# Altium project DIGLITE.PrjPcb (part 1 of 2)
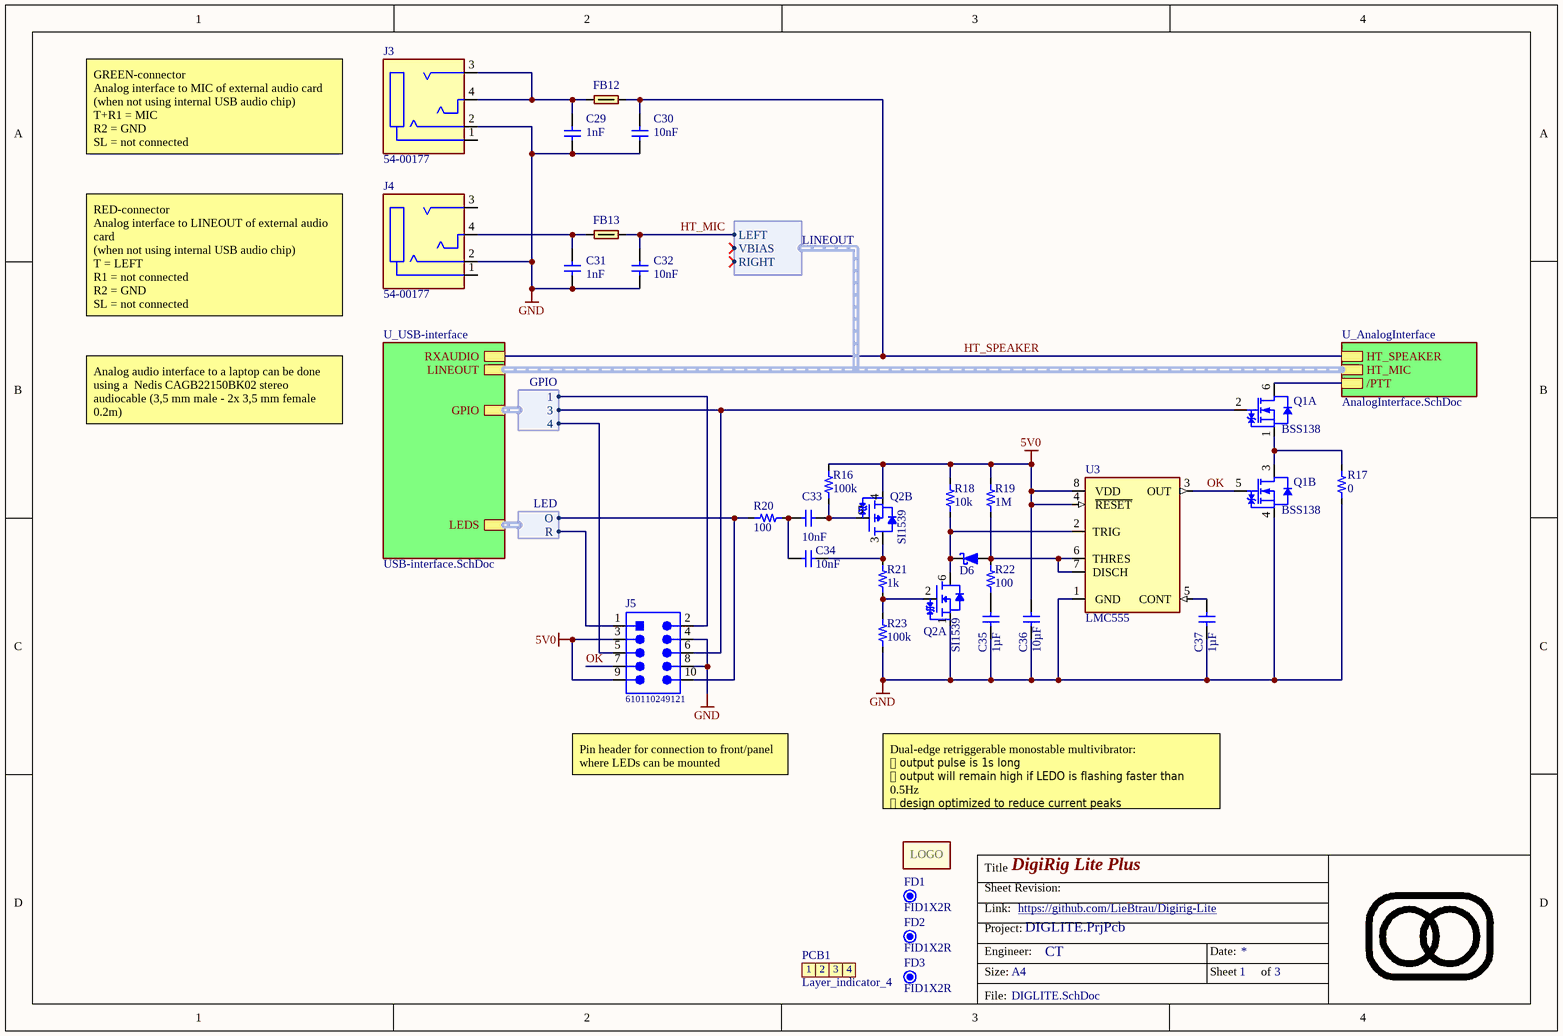
[diagram p0: DIGLITE.SchDoc]
assembly_revision: 0; board_name: DIGLITE; board_revision: 1.0; Project_link: https://github.com/LieBtrau/Digirig-Lite
3 sheets, 119 parts. Net scope: hierarchical (ports join the sheet entries above them; power ports are global).
Board file: DIGLITE.PcbDoc
Sheets:
  DIGLITE.SchDoc
    U_USB-interface = USB-interface.SchDoc
    U_AnalogInterface = AnalogInterface.SchDoc

## Sheet DIGLITE.SchDoc: DigiRig Lite Plus
size A4; Engineer: CT; SheetNumber: 1; SheetTotal: 3

### Parts
C29  value 1nF  [0603-C-N]  (hidden comment: Capacitor 1 nF +/-5% 50V C0G 0603)
C30  value 10nF  [0603-C-N]  (hidden comment: Capacitor 10nF 50V NP0 0603)
C31  value 1nF  [0603-C-N]  (hidden comment: Capacitor 1 nF +/-5% 50V C0G 0603)
C32  value 10nF  [0603-C-N]  (hidden comment: Capacitor 10nF 50V NP0 0603)
C33  value 10nF  [0603-C-N]  (hidden comment: Capacitor 10nF 50V NP0 0603)
C34  value 10nF  [0603-C-N]  (hidden comment: Capacitor 10nF 50V NP0 0603)
C35  value 1µF  [0603-C-N]  (hidden comment: Capacitor 1µF +/-10% 16V X7R 0603)
C36  value 10µF  [WCAP-CSGP_1210_L3.2W2.5H2.5]  (hidden comment: Capacitor 10µF +/-10% 50V X7R 1210)
C37  value 1µF  [0603-C-N]  (hidden comment: Capacitor 1µF +/-10% 16V X7R 0603)
D6  RB521SM-30T2R  [FP-SOD523-MFG]  (value not drawn)
FB12  742792662  [0603-FB-N]  (value not drawn)
FB13  742792662  [0603-FB-N]  (value not drawn)
FD1  FID1X2R  [FID1X2R]  (no BOM)
FD2  FID1X2R  [FID1X2R]  (no BOM)
FD3  FID1X2R  [FID1X2R]  (no BOM)
J3  54-00177  [54-00177-Footprint-1]
J4  54-00177  [54-00177-Footprint-1]
J5  610110249121  [610110249121]
M1  Logo  [LOGO_9x6mm]  (value not drawn)  (no BOM)
PCB1  Layer_indicator_4  [LayerId_4L_4x1.5mm]  (no BOM)
Q1  value BSS138  [SOT-363-N]  (hidden comment: BSS138PS.115)  (parts A,B of 2)
Q2  value SI1539  [SOT-363-N]  (hidden comment: SI1539CDL-T1-GE3)  (parts A,B of 2)
R16  value 100k  [0603-R-N]  (hidden comment: Resistor 100k +/-1% 50V 0603)
R17  value 0  [0603-R-N]  (hidden comment: Jumper 0R <50 mOhm 1A 0603)
R18  value 10k  [0603-R-N]  (hidden comment: Resistor 10k +/-1% 50V 0603)
R19  value 1M  [0603-R-N]  (hidden comment: Resistor 1M +/-1% 50V 0603)
R20  value 100  [0603-R-N]  (hidden comment: Resistor 100R +/-1% 50V 0603)
R21  value 1k  [0603-R-N]  (hidden comment: Resistor 1k +/-1% 50V 0603)
R22  value 100  [0603-R-N]  (hidden comment: Resistor 100R +/-1% 50V 0603)
R23  value 100k  [0603-R-N]  (hidden comment: Resistor 100k +/-1% 50V 0603)
U3  value LMC555  [VSSOP8]  (hidden comment: LMC555CMM/NOPB)

### Sub-sheets
U_AnalogInterface = AnalogInterface.SchDoc: /PTT, HT_SPEAKER, HT_MIC (harness LINEOUT)
U_USB-interface = USB-interface.SchDoc: RXAUDIO, LINEOUT (harness LINEOUT), LEDS (harness LED), GPIO (harness GPIO)

### Harnesses
LED: O, R
GPIO: 1, 3, 4
LINEOUT: LEFT, VBIAS, RIGHT

### Nets
5V0: C36.2 J5.3 J5.9 Q2.4(S) R16.2 R18.2 R19.2 U3.4(~{RESET}) U3.8(VDD)
GND: C29.2 C30.2 C31.2 C32.2 C35.1 C36.1 C37.1 J3.2 J4.2 J5.4 J5.8 Q1.4(S) Q2.1(S) R17.1 R23.1 U3.1(GND)
HT_MIC: C32.1 FB13.2 ; sheet U_USB-interface/LINEOUT.LEFT
HT_SPEAKER: C30.1 FB12.2 ; sheet U_USB-interface/RXAUDIO, sheet U_AnalogInterface/HT_SPEAKER
OK: J5.7 Q1.5(G) U3.3(OUT)
NetC29_1: C29.1 FB12.1 J3.3 J3.4
NetC31_1: C31.1 FB13.1 J4.4
NetC33_1: C33.1 C34.1 R20.1
NetC33_2: C33.2 Q2.5(G) R16.1
NetC34_2: C34.2 Q2.3(D) R21.1
NetC35_2: C35.2 R22.1
NetC37_2: C37.2 U3.5(CONT)
NetD6_1: D6.1(K) Q2.6(D) R18.1 U3.2(TRIG)
NetD6_2: D6.2(A) R19.1 R22.2 U3.6(THRES) U3.7(DISCH)
NetJ5_1: J5.1 ; sheet U_USB-interface/LEDS.R
NetJ5_2: J5.2 ; sheet U_USB-interface/GPIO.1
NetJ5_5: J5.5 ; sheet U_USB-interface/GPIO.4
NetJ5_6: J5.6 Q1.2(G) ; sheet U_USB-interface/GPIO.3
NetJ5_10: J5.10 R20.2 ; sheet U_USB-interface/LEDS.O
NetQ1_1: Q1.1(S) Q1.3(D) R17.2
NetQ1_6: Q1.6(D) ; sheet U_AnalogInterface//PTT
NetQ2_2: Q2.2(G) R21.2 R23.2

Not connected (* = marked no-connect by the designer): J3 1; J4 1 3

### Buses and harness runs
harness sheet U_AnalogInterface/HT_MIC = sheet U_USB-interface/LINEOUT

### Notes on the sheet
- GREEN-connector
  Analog interface to MIC of external audio card
  (when not using internal USB audio chip)
  T+R1 = MIC
  R2 = GND
  SL = not connected
- RED-connector
  Analog interface to LINEOUT of external audio card
  (when not using internal USB audio chip)
  T = LEFT
  R1 = not connected
  R2 = GND
  SL = not connected
- Analog audio interface to a laptop can be done using a  Nedis CAGB22150BK02 stereo audiocable (3,5 mm male - 2x 3,5 mm female 0.2m)
- Pin header for connection to front/panel
  where LEDs can be mounted
- Dual-edge retriggerable monostable multivibrator:
  ⦿ output pulse is 1s long
  ⦿ output will remain high if LEDO is flashing faster than 0.5Hz
  ⦿ design optimized to reduce current peaks
- Title
- Sheet Revision:
- Link:
- Size:
- Project:
- Engineer:
- A4
- Date:
- Sheet
- of
- File:
- (in symbol CMP-000006-6) 1; 2; 3; 4
- (in symbol Logo) LOGO

### Library data of the parts
C29 C31 = CMP-001-00112-14: Capacitor MLCC, General Purpose, size 0603, C0G, 1 nF, +/-5%, 50V; Page Part #: CCQK102T2; Tolerance: 5%; Case/Package: 0603; Width: 0.8mm; Min Operating Temperature: -55°C; Mounting Technology: SMT; Dielectric: C0G; Packaging: Cut Tape; Max Operating Temperature: 125°C; Voltage Rating: 50V; Height: 0.8mm; Length: 1.6mm; JLCPCB Part #: C340644; REACH SVHC: Unknown; Capacitor Type: MLCC; Usage: General Purpose; Pins: 2
C30 C32-C34 = CMP-001-00137-7: Multilayer Ceramic Capacitor, Grm Series, 0.01 F, 5%, C0g / Np0, 50 V, 0603 [1608 Metric]; FLIR Part #: YCAM10N-7; Page Part #: CCQJ103T; Temperature Coefficient: 30ppm/°C; Reach SVHC Compliant: No; Case/Package: 0603; Thickness: 0.035inch; Width: 0.8mm; Case Code (Metric): 1608; Termination: SMD/SMT; Min Operating Temperature: -55°C; Voltage Rating (DC): 50V; Mounting Technology: Surface Mount; Package Quantity: 4000; Depth: 0.8mm; Dielectric: C0G; Packaging: Cut Tape; Voltage: 50V; Max Operating Temperature: 125°C; RoHS Compliant: Yes; Material: Ceramic; Lead Pitch: 0.5mm; Case Code (Imperial): 0603; Tolerance: 5%; Voltage Rating: 50V; Lead Free: Lead Free; Height: 0.8mm; Length: 1.6mm; JLCPCB Part #: C85973; Series: GRM
C35 C37 = CMP-001-00004-22: Capacitor MLCC, General Purpose, size 0603, X7R, 1µF, +/-10%, 16V; Tolerance: 10%; Mounting Technology: SMT; Usage: General Purpose; Case/Package: 0603; Max Operating Temperature: 125°C; JLCPCB Part #: C15849; Dielectric: X7R; RoHS Compliant: True; Height: 0.8mm; Width: 0.8mm; Capacitor Type: MLCC; Voltage Rating: 16V; Length: 1.6mm; Pins: 2; Min Operating Temperature: -55°C
C36 = CMP-072-000922-16: WCAP-CSGP Multilayer Ceramic Chip Capacitor, General Purpose, size 1210, X7R, 10µF, 50VDC; Tolerance: 10%; Technical Reference: X7R1210106K050DFCT10000; Insulation Resistance: 0.01GO; Capacitor Type: MLCC; ComponentLink2URL: https://www.we-online.com/redexpert/spec/885012209073?ad; ComponentLink1URL: https://www.we-online.com/redexpert/article/885012209073?ad; Source: WCAP-CSGP.SchLib; Case/Package: 1210; Packaging: Tape and Reel; ComponentLink1Description: Website Link; Pins: 2; Width: 2.5mm; Voltage Rating: 50V; ComponentLink2Description: Datasheet Link; Match Code: WCAP-CSGP; Max Operating Temperature: 125°C; Usage: General Purpose; JLCPCB Part #: C77102; Height: 2.5mm; Dielectric: X7R; Dissipation Factor: 10%; Length: 3.2mm; Min Operating Temperature: -55°C; Design Item ID: 885012209073; Mounting Technology: SMT
D6 = CMP-004-00062-1: RB521SM Series 30 V 200 mA Surface Mount Schottky Barrier Diode -SOD-523 (SC-79); Forward Voltage: 470mV; Forward Current: 200mA; Max Repetitive Reverse Voltage (Vrrm): 30V; Max Forward Surge Current (Ifsm): 1A; Element Configuration: Single; Number of Elements: 1; Peak Reverse Current: 30µA; JLCPCB Part #: C727120; Case/Package: SOD-523-2; Packaging: Tape & Reel; Radiation Hardening: No; Max Reverse Voltage (DC): 30V; Width: 800µm; Number of Terminals: 2; Min Operating Temperature: -40°C; Average Rectified Current: 200mA; REACH SVHC: Yes; Max Operating Temperature: 150°C; RoHS: Compliant; Pins: 2; Length: 1.2mm; Peak Non-Repetitive Surge Current: 1A; Lead Free: Lead Free; Reverse Standoff Voltage: 30V; Mounting Technology: Surface Mount; Max Output current: 200mA; Height: 600µm; Lifecycle Status: Production; Weight: 992.233309µg
FB12 FB13 = CMP-066-000126-8: WE-CBF SMT EMI Suppression Ferrite Bead, size 0603, 1000O, 0.83A; Manufacturer: Wurth Elektronik; Page Part #: FILTER279; Case/Size Code: 0603; Impedance Max Test Condition: 120MHz; Type: Wide Band; DC Resistance Max: 0.3O; Impedance Max: 1050O; Rated Current: 0.6A; Mount: Surface Mount; Impedance @100MHz: 1000O; JLCPCB Part #: C180490; ComponentLink1URL: https://www.we-online.com/redexpert/article/742792662?ad; ComponentLink2URL: https://www.we-online.com/redexpert/spec/742792662?ad; Length: 1.6mm; ComponentLink1Description: Website Link; Manufacturer Part Number: 742792662; Width: 0.8mm; Match Code: WE-CBF; Component Type: Standard; Design Item ID: 742792662; Pin Count: 2; Operating Temperature Max: 125°C; Packaging: Tape and Reel; ComponentLink2Description: Datasheet Link; Operating Temperature Min: -55°C; Category: Ferrites for PCB Assembly; Height: 0.8mm
FD1-FD3 = CMP-00028-00005-14: Fiducial - Round 1x2mm; Pins: 0
J3 J4 = CMP-002-00136-2: Conn Jack 4 Cond 3.5MM SMD R/a; Shielding: Shielded; Body Color: Black; Gender: Female; Min Operating Temperature: -40°C; Termination: Solder; Mounting Technology: Surface Mount; JLCPCB Part #: C7507452; Max Operating Temperature: 105°C; Contact Plating: Gold; Contact Material: Bronze; Series: -
J5 = CMP-045-000083-5: WR-PHD Pin Header, SMT, pitch 2.54mm, Dual Row, Angled, 10p; Manufacturer: Wurth Elektronik; Rated Current: 3A; Working Voltage: 250VAC; Contact Resistance: 20mOhm; Pin Number: 10; Withstanding Voltage: 600VAC; Component Type: Standard; Packaging: Tape and Reel; ComponentLink1Description: Manufacturer; Operating Temperature: -40 to +105degC; ComponentLink1URL: http://www.we-online.de; Source: WR-PHD_Pin Header.SchLib; Design Item ID: 610110249121; Pitch: 2.54mm; ComponentLink2Description: Datasheet; ComponentLink2URL: https://www.we-online.com/catalog/datasheet/610110249121.pdf; Gender: Pin Header; Orientation: Angled; Row Number: Dual; Pin Count: 10; Manufacturer Part Number: 610110249121; Mounting Technology: SMT; JLCPCB Part #: C5149355
PCB1 = CMP-000006-6: Layer indicator for 4 layers
Q1 = CMP-013-00062-13: Transistor MOSFET Array Dual N-CH 60V 320mA 6-Pin TSSOP T/R; Page Part #: TBSS138PS; Transistor Type: NMOS, NMOS; Fall Time: 4ns; Input Capacitance: 50pF; Turn-On Delay Time: 2ns; Turn-Off Delay Time: 9ns; Gate to Source Voltage (Vgs): 20V; Power Dissipation: 280mW; Threshold Voltage: 1.2V; Rds On Max: 1.6R; Max Power Dissipation: 420mW; Rise Time: 3ns; Max Operating Temperature: 150°C; Drain to Source Voltage (Vdss): 60V; Max Dual Supply Voltage: 60V; JLCPCB Part #: C154900; Drain to Source Breakdown Voltage: 60V; Contact Plating: Tin; Min Operating Temperature: -55°C; Packaging: Tape and Reel; Case/Package: SOT-363; Continuous Drain Current (ID): 320mA; Radiation Hardening: No; Lead Free: Lead Free; RoHS Compliant: Yes; Drain to Source Resistance: 1.6R; Reach SVHC Compliant: Yes; Pins: 6
Q2 = CMP-142-000016-6: Trans Mosfet N/p-ch 30V 0.7A/0.4A 6-PIN SC-70 T/r / Mosfet N/p-ch 30V SOT363; Turn-On Delay Time: 32ns; Rise Time: 19ns; FET Type: N and P-Channel; Max Power Dissipation: 340mW; Drain to Source Resistance: 740mR; Threshold Voltage: 1.2V; Polarity: N-CHANNEL,P-CHANNEL; Continuous Drain Current (ID): 700mA; Rds On Max: 388mR; Fall Time: 10ns; Gate to Source Voltage (Vgs): 20V; Number of Channels: 2; Input Capacitance: 28pF; Turn-Off Delay Time: 4ns; Transistor Type: CMOS; Drain to Source Voltage (Vdss): 30V; JLCPCB Part #: C141530; Lead Free: Lead Free; Pins: 6; Series: TrenchFET®; Radiation Hardening: No; Case/Package: SOT-363; Packaging: Tape and Reel; Reach SVHC Compliant: No; Min Operating Temperature: -55°C; Weight: 0.000988oz; Mounting Technology: Surface Mount; Package Quantity: 3000; Max Operating Temperature: 150°C; RoHS Compliant: Yes
R16 R23 = CMP-009-00023-29: Chip Resistor, Thick Film, General Purpose, 0603, 100mW, 50V, 100 kOhm, +/-1%; Page Part #: ROQF1003; Tolerance: 1%; Elements: 1; Max Operating Temperature: 155°C; Usage: General Purpose; Mounting Technology: SMT; Voltage Rating: 50V; Power Rating: 100mW; Min Operating Temperature: -55°C; RoHS Compliant: Yes; Pins: 2; Resistor Type: Thick Film; JLCPCB Part #: C25803; Case/Package: 0603; JLCPCB Basic part: Yes
R17 = CMP-009-00006-27: Chip Jumper, Thick Film, Jumper, 0603, 100mW, 1A, 0 Ohm, <50 mOhm; FLIR Part #: YRES0E-1; Page Part #: ROQJ0000; Elements: 1; Tolerance: 50 mOhm; Voltage Rating: 75V; Min Operating Temperature: -55°C; RoHS Compliant: True; Usage: Jumper; Mounting Technology: SMT; Max Operating Temperature: 155°C; Case/Package: 0603; JLCPCB Part #: C21189; Current Rating: 1A; Resistor Type: Thick Film; Power Rating: 100mW; Pins: 2; JLCPCB Basic Part: Yes
R18 = CMP-009-00017-29: Chip Resistor, Thick Film, General Purpose, 0603, 100mW, 50V, 10 kOhm, +/-1%; FLIR Part #: YRES10K-1; Page Part #: ROQF1002; Elements: 1; Tolerance: 1%; Pins: 2; Resistor Type: Thick Film; Voltage Rating: 50V; Power Rating: 100mW; Mounting Technology: SMT; Min Operating Temperature: -55°C; Case/Package: 0603; RoHS Compliant: Yes; Usage: General Purpose; JLCPCB Part #: C25804; Max Operating Temperature: 155°C; JLCPCB Basic part: Yes
R19 = CMP-009-00234-18: Chip Resistor, Thick Film, General Purpose, 0603, 100mW, 50V, 1 MOhm, +/-1%; Tolerance: 1%; Elements: 1; RoHS Compliant: Yes; Mounting Technology: SMT; Max Operating Temperature: 155°C; Resistor Type: Thick Film; Usage: General Purpose; Voltage Rating: 50V; Min Operating Temperature: -55°C; Power Rating: 100mW; JLCPCB Part #: C22935; Pins: 2; Case/Package: 0603; JLCPCB Basic Part: Yes
R20 R22 = CMP-009-00232-18: Chip Resistor, Thick Film, General Purpose, 0603, 63mW, 50V, 100 Ohm, +/-1%; Page Part #: ROQF1000; Temperature Coefficient: 100ppm/°C; Power Rating: 100mW; Elements: 1; Tolerance: 1%; Resistor Type: Thick Film; Usage: General Purpose; Voltage Rating: 50V; RoHS Compliant: Yes; JLCPCB Part #: C22775; Mounting Technology: SMT; Case/Package: 0603; Max Operating Temperature: 155°C; Pins: 2; Min Operating Temperature: -55°C
R21 = CMP-009-00014-30: Chip Resistor, Thick Film, General Purpose, 0603, 100mW, 50V, 1 kOhm, +/-1%; FLIR Part #: YRES1K-1; Page Part #: ROQF1001; Tolerance: 1%; Elements: 1; JLCPCB Part #: C21190; Pins: 2; Resistor Type: Thick Film; RoHS Compliant: Yes; Case/Package: 0603; Min Operating Temperature: -55°C; Power Rating: 100mW; Mounting Technology: SMT; Usage: General Purpose; Max Operating Temperature: 155°C; Voltage Rating: 50V; JLCPCB Basic Part: Yes
U3 = CMP-023-00008-3: World’s smallest 555 timer with low power, high accuracy and a Fmax of 3MHz 8-VSSOP -40 to 85; Propagation Delay: 100ns; Min Supply Voltage: 1.5V; Number of Timers/Counters: 1; Current Rating: 150A; Max Supply Voltage: 15V; Output Current: 100mA; Power Dissipation: 555mW; Supply Current: 50uA; Operating Supply Current: 150uA; Low Level Output Current: 50mA; Quiescent Current: 400uA; High Level Output Current: -10mA; Height: 0.86mm; Packaging: Tape and Reel; Min Operating Temperature: -40°C; Width: 3mm; Package Quantity: 1000; Turn-On Delay Time: 100ns; Reach SVHC Compliant: No; Frequency: 3MHz; Lead Free: Lead Free; Case/Package: MSOP; RoHS Compliant: Yes; Radiation Hardening: No; Max Power Dissipation: 555mW; JLCPCB Part #: C5160090; Pins: 8; Series: -; Thickness: 970um; Mounting Technology: Surface Mount; Length: 3mm; Max Operating Temperature: 125°C; Number of Channels: 1

## Sheet USB-interface.SchDoc: USB-interface
size A4; Engineer: CT; SheetNumber: 2; SheetTotal: 3
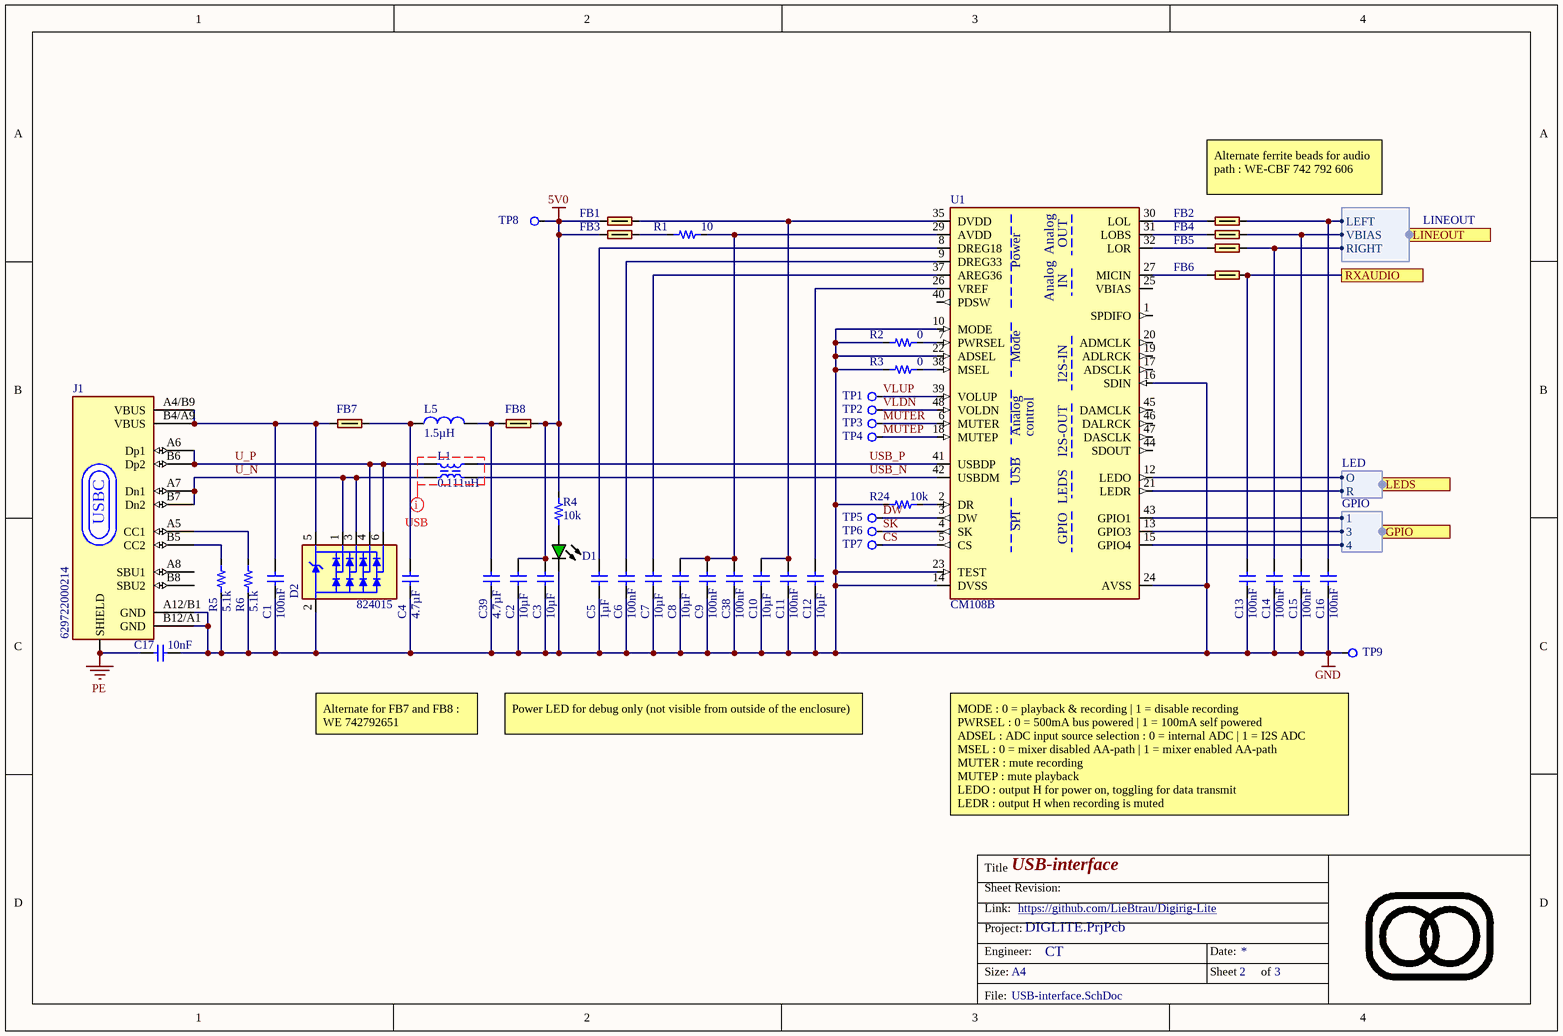
[diagram p1: USB-interface.SchDoc]

### Parts
C1  value 100nF  [0603-C-N]  (hidden comment: alternative Capacitor 100nF +/-10% 50V X7R 0603)
C2  value 10µF  [WCAP-CSGP_1210_L3.2W2.5H2.5]  (hidden comment: Capacitor 10µF +/-10% 50V X7R 1210)
C3  value 10µF  [WCAP-CSGP_1210_L3.2W2.5H2.5]  (hidden comment: Capacitor 10µF +/-10% 50V X7R 1210)
C4  value 4.7µF  [1206-C-N]  (hidden comment: Capacitor 4.7µF +/-10% 10V X7R 1206)
C5  value 1µF  [0603-C-N]  (hidden comment: Capacitor 1µF +/-10% 16V X7R 0603)
C6  value 100nF  [0603-C-N]  (hidden comment: alternative Capacitor 100nF +/-10% 50V X7R 0603)
C7  value 10µF  [WCAP-CSGP_1210_L3.2W2.5H2.5]  (hidden comment: Capacitor 10µF +/-10% 50V X7R 1210)
C8  value 10µF  [WCAP-CSGP_1210_L3.2W2.5H2.5]  (hidden comment: Capacitor 10µF +/-10% 50V X7R 1210)
C9  value 100nF  [0603-C-N]  (hidden comment: alternative Capacitor 100nF +/-10% 50V X7R 0603)
C10  value 10µF  [WCAP-CSGP_1210_L3.2W2.5H2.5]  (hidden comment: Capacitor 10µF +/-10% 50V X7R 1210)
C11  value 100nF  [0603-C-N]  (hidden comment: alternative Capacitor 100nF +/-10% 50V X7R 0603)
C12  value 10µF  [WCAP-CSGP_1210_L3.2W2.5H2.5]  (hidden comment: Capacitor 10µF +/-10% 50V X7R 1210)
C13  value 100nF  [0603-C-N]  (hidden comment: alternative Capacitor 100nF +/-10% 50V X7R 0603)
C14  value 100nF  [0603-C-N]  (hidden comment: alternative Capacitor 100nF +/-10% 50V X7R 0603)
C15  value 100nF  [0603-C-N]  (hidden comment: alternative Capacitor 100nF +/-10% 50V X7R 0603)
C16  value 100nF  [0603-C-N]  (hidden comment: alternative Capacitor 100nF +/-10% 50V X7R 0603)
C17  value 10nF  [0603-C-N]  (hidden comment: Capacitor 10nF 50V NP0 0603)
C38  value 100nF  [0603-C-N]  (hidden comment: alternative Capacitor 100nF +/-10% 50V X7R 0603)
C39  value 4.7µF  [1206-C-N]  (hidden comment: Capacitor 4.7µF +/-10% 10V X7R 1206)
D1  150060GS84000  [WL-SMCW_0603_150060xx8x000]  (value not drawn)
D2  824015  [SOT-23-6]
FB1  742792662  [0603-FB-N]  (value not drawn)
FB2  742792662  [0603-FB-N]  (value not drawn)
FB3  742792662  [0603-FB-N]  (value not drawn)
FB4  742792662  [0603-FB-N]  (value not drawn)
FB5  742792662  [0603-FB-N]  (value not drawn)
FB6  742792662  [0603-FB-N]  (value not drawn)
FB7  74279221111  [WE-CBF_1206_Medium Current]  (value not drawn)
FB8  74279221111  [WE-CBF_1206_Medium Current]  (value not drawn)
J1  629722000214  [629722000214]
L1  Inductance: 0.111uH  [WE-CNSW_1206]  (hidden comment: 744232090)
L5  value 1.5µH  [WE-MAPI_2512]  (hidden comment: 74438324015)
R1  value 10  [0603-R-N]  (hidden comment: Resistor 10R +/-1% 50V 0603)
R2  value 0  [0603-R-N]  (hidden comment: Jumper 0R <50 mOhm 1A 0603)
R3  value 0  [0603-R-N]  (hidden comment: Jumper 0R <50 mOhm 1A 0603)
R4  value 10k  [0603-R-N]  (hidden comment: Resistor 10k +/-1% 50V 0603)
R5  value 5.1k  [0603-R-N]  (hidden comment: Resistor 5.1k +/-1% 50V 0603)
R6  value 5.1k  [0603-R-N]  (hidden comment: Resistor 5.1k +/-1% 50V 0603)
R24  value 10k  [0603-R-N]  (hidden comment: Resistor 10k +/-1% 50V 0603)
TP1  Testpad with multiple sizes  [TP_1.5mm_0.3mmHole]  (value not drawn)  (no BOM)
TP2  Testpad with multiple sizes  [TP_1.5mm_0.3mmHole]  (value not drawn)  (no BOM)
TP3  Testpad with multiple sizes  [TP_1.5mm_0.3mmHole]  (value not drawn)  (no BOM)
TP4  Testpad with multiple sizes  [TP_1.5mm_0.3mmHole]  (value not drawn)  (no BOM)
TP5  Testpad with multiple sizes  [TP_1.5mm_0.3mmHole]  (value not drawn)  (no BOM)
TP6  Testpad with multiple sizes  [TP_1.5mm_0.3mmHole]  (value not drawn)  (no BOM)
TP7  Testpad with multiple sizes  [TP_1.5mm_0.3mmHole]  (value not drawn)  (no BOM)
TP8  Testpad with multiple sizes  [TP_1.5mm_0.3mmHole]  (value not drawn)  (no BOM)
TP9  Testpad with multiple sizes  [TP_1.5mm_0.3mmHole]  (value not drawn)  (no BOM)
U1  CM108B  [TSQFP50P900X900X160-48N]

### Ports
GPIO (harness GPIO), LEDS (harness LED), LINEOUT (harness LINEOUT), RXAUDIO

### Harnesses
LINEOUT: LEFT, VBIAS, RIGHT
LED: O, R
GPIO: 1, 3, 4

### Nets
5V0: C2.2 C3.2 FB1.1 FB3.1 FB8.2 R4.2 TP8.1(Pad)
GND: C1.1 C2.1 C3.1 C4.1 C5.1 C6.1 C7.1 C8.1 C9.1 C10.1 C11.1 C12.1 C13.2 C14.2 C15.2 C16.2 C17.2 C38.1 C39.1 D1.1(K) D2.2 J1.A12/B1(GND) J1.B12/A1(GND) R2.1 R3.1 R5.1 R6.1 R24.2 TP9.1(Pad) U1.10(MODE) U1.14(DVSS) U1.16(SDIN) U1.22(ADSEL) U1.23(TEST) U1.24(AVSS)
PE: C17.1 J1.MNT(SHIELD)
CS: TP7.1(Pad) U1.5(CS)
DW: TP5.1(Pad) U1.3(DW)
HT_MIC: C16.1 FB2.2 ; port LINEOUT.LEFT
HT_SPEAKER: C13.1 FB6.2 ; port RXAUDIO
MUTEP: TP4.1(Pad) U1.18(MUTEP)
MUTER: TP3.1(Pad) U1.6(MUTER)
SK: TP6.1(Pad) U1.4(SK)
U_N: D2.1 D2.3 J1.A7(Dn1) J1.B7(Dn2) L1.4
U_P: D2.4 D2.6 J1.A6(Dp1) J1.B6(Dp2) L1.1
USB_N: L1.3 U1.42(USBDM)
USB_P: L1.2 U1.41(USBDP)
VLDN: TP2.1(Pad) U1.48(VOLDN)
VLUP: TP1.1(Pad) U1.39(VOLUP)
NetC1_2: C1.2 D2.5 FB7.1 J1.A4/B9(VBUS) J1.B4/A9(VBUS)
NetC4_2: C4.2 FB7.2 L5.1
NetC5_2: C5.2 U1.8(DREG18)
NetC6_2: C6.2 U1.9(DREG33)
NetC7_2: C7.2 U1.37(AREG36)
NetC8_2: C8.2 C9.2 C38.2 R1.2 U1.29(AVDD)
NetC10_2: C10.2 C11.2 FB1.2 U1.35(DVDD)
NetC12_2: C12.2 U1.26(VREF)
NetC14_1: C14.1 FB5.2 ; port LINEOUT.RIGHT
NetC15_1: C15.1 FB4.2 ; port LINEOUT.VBIAS
NetC39_2: C39.2 FB8.1 L5.2
NetD1_2: D1.2(A) R4.1
NetFB2_1: FB2.1 U1.30(LOL)
NetFB3_2: FB3.2 R1.1
NetFB4_1: FB4.1 U1.31(LOBS)
NetFB5_1: FB5.1 U1.32(LOR)
NetFB6_1: FB6.1 U1.27(MICIN)
NetJ1_A5: J1.A5(CC1) R6.2
NetJ1_B5: J1.B5(CC2) R5.2
NetJ5_1: U1.21(LEDR) ; port LEDS.R
NetJ5_2: U1.43(GPIO1) ; port GPIO.1
NetJ5_5: U1.15(GPIO4) ; port GPIO.4
NetJ5_6: U1.13(GPIO3) ; port GPIO.3
NetJ5_10: U1.12(LEDO) ; port LEDS.O
NetR2_2: R2.2 U1.7(PWRSEL)
NetR3_2: R3.2 U1.38(MSEL)
NetR24_1: R24.1 U1.2(DR)

Not connected (* = marked no-connect by the designer): J1 A8(SBU1) B8(SBU2); U1 1(SPDIFO) 17(ADSCLK) 19(ADLRCK) 20(ADMCLK) 25(VBIAS) 40(PDSW) 44(SDOUT) 45(DAMCLK) 46(DALRCK) 47(DASCLK)

### Layout directives
differential pair: (no net found under the mark)

### Notes on the sheet
- Alternate ferrite beads for audio path : WE-CBF 742 792 606
- Alternate for FB7 and FB8 : WE 742792651
- Power LED for debug only (not visible from outside of the enclosure)
- (near TP9) MODE : 0 = playback & recording | 1 = disable recording
  PWRSEL : 0 = 500mA bus powered | 1 = 100mA self powered
  ADSEL : ADC input source selection : 0 = internal ADC | 1 = I2S ADC
  MSEL : 0 = mixer disabled AA-path | 1 = mixer enabled AA-path
  MUTER : mute recording
  MUTEP : mute playback
  LEDO : output H for power on, toggling for data transmit
  LEDR : output H when recording is muted
- Title
- Sheet Revision:
- Link:
- Size:
- Project:
- Engineer:
- A4
- Date:
- Sheet
- of
- File:
- (in symbol CMP-015-00044-4) OUT; Analog; Power; IN; Mode; I2S-IN; control; I2S-OUT; USB; LEDS; SPI; GPIO
- (in symbol CMP-088-000027-14) USBC

### Library data of the parts
C1 C6 C9 C11 C38 = CMP-072-000619-17: WCAP-CSGP Multilayer Ceramic Chip Capacitor, General Purpose, size 0603, X7R, 100nF, 50VDC; Dissipation Factor: 3%; Tolerance: 10%; Capacitor Type: MLCC; Insulation Resistance: 5GO; Technical Reference: X7R0603104K050DFCT10000; ComponentLink2Description: Datasheet Link; Dielectric: X7R; ComponentLink2URL: https://www.we-online.com/redexpert/spec/885012206095?ad; Case/Package: 0603; Voltage Rating: 50V; Height: 0.8mm; JLCPCB Part #: C14663; Design Item ID: 885012206095; Pins: 2; Min Operating Temperature: -55°C; Max Operating Temperature: 125°C; Width: 0.8mm; ComponentLink1URL: https://www.we-online.com/redexpert/article/885012206095?ad; Match Code: WCAP-CSGP; Packaging: Tape and Reel; Source: WCAP-CSGP.SchLib; Usage: General Purpose; Length: 1.6mm; ComponentLink1Description: Website Link; Mounting Technology: SMT
C2 C3 C7 C8 C10 C12 = CMP-072-000922-16: as C36 on sheet DIGLITE; ComponentLink2URL: https://www.we-online.com/redexpert/spec/885012209073?ad; ComponentLink1URL: https://www.we-online.com/redexpert/article/885012209073?ad; Source: WCAP-CSGP.SchLib; Case/Package: 1210; Packaging: Tape and Reel; ComponentLink1Description: Website Link; Pins: 2; Width: 2.5mm; Voltage Rating: 50V; ComponentLink2Description: Datasheet Link; Match Code: WCAP-CSGP; Max Operating Temperature: 125°C; Usage: General Purpose; JLCPCB Part #: C77102; Height: 2.5mm; Dielectric: X7R; Dissipation Factor: 10%; Length: 3.2mm; Min Operating Temperature: -55°C; Design Item ID: 885012209073; Mounting Technology: SMT
C4 C39 = CMP-072-000776-16: WCAP-CSGP Multilayer Ceramic Chip Capacitor, General Purpose, size 1206, X7R, 4.7µF, 10VDC; Dissipation Factor: 10%; Capacitor Type: MLCC; Insulation Resistance: 0.02GO; Technical Reference: X7R1206475K010DFCT10000; ComponentLink2Description: Datasheet Link; Dielectric: X7R; ComponentLink2URL: https://www.we-online.com/redexpert/spec/885012208017?ad; Case/Package: 1206; Voltage Rating: 10V; Height: 1.6mm; Tolerance: 10%; Design Item ID: 885012208017; Pins: 2; Min Operating Temperature: -55°C; Max Operating Temperature: 125°C; Width: 1.6mm; ComponentLink1URL: https://www.we-online.com/redexpert/article/885012208017?ad; Match Code: WCAP-CSGP; Packaging: Tape and Reel; Source: WCAP-CSGP.SchLib; Usage: General Purpose; Length: 3.2mm; ComponentLink1Description: Website Link; Mounting Technology: SMT; JLCPCB Basic Part: Yes; JLCPCB Part #: C29823
C5 = CMP-001-00004-22: as C35 on sheet DIGLITE; Mounting Technology: SMT; Usage: General Purpose; Case/Package: 0603; Max Operating Temperature: 125°C; JLCPCB Part #: C15849; Dielectric: X7R; RoHS Compliant: True; Height: 0.8mm; Width: 0.8mm; Capacitor Type: MLCC; Voltage Rating: 16V; Length: 1.6mm; Pins: 2; Min Operating Temperature: -55°C
C13-C16 = CMP-072-000619-17: WCAP-CSGP Multilayer Ceramic Chip Capacitor, General Purpose, size 0603, X7R, 100nF, 50VDC; Tolerance: 10%; Dissipation Factor: 3%; Capacitor Type: MLCC; Insulation Resistance: 5GO; Technical Reference: X7R0603104K050DFCT10000; Case/Package: 0603; Width: 0.8mm; Min Operating Temperature: -55°C; Mounting Technology: SMT; Dielectric: X7R; Packaging: Tape and Reel; Max Operating Temperature: 125°C; Voltage Rating: 50V; Height: 0.8mm; Length: 1.6mm; JLCPCB Part #: C14663; ComponentLink2Description: Datasheet Link; ComponentLink2URL: https://www.we-online.com/redexpert/spec/885012206095?ad; Design Item ID: 885012206095; Pins: 2; ComponentLink1URL: https://www.we-online.com/redexpert/article/885012206095?ad; Match Code: WCAP-CSGP; Source: WCAP-CSGP.SchLib; Usage: General Purpose; ComponentLink1Description: Website Link
C17 = CMP-001-00137-7: as C30 on sheet DIGLITE; Reach SVHC Compliant: No; Case/Package: 0603; Thickness: 0.035inch; Width: 0.8mm; Case Code (Metric): 1608; Termination: SMD/SMT; Min Operating Temperature: -55°C; Voltage Rating (DC): 50V; Mounting Technology: Surface Mount; Package Quantity: 4000; Depth: 0.8mm; Dielectric: C0G; Packaging: Cut Tape; Voltage: 50V; Max Operating Temperature: 125°C; RoHS Compliant: Yes; Material: Ceramic; Lead Pitch: 0.5mm; Case Code (Imperial): 0603; Tolerance: 5%; Voltage Rating: 50V; Lead Free: Lead Free; Height: 0.8mm; Length: 1.6mm; JLCPCB Part #: C85973; Series: GRM
D1 = CMP-002-001076-16: WL-SMCW Mono-color Chip LED Waterclear, size 0603, Green, 3.3V, 40°; Manufacturer: Wurth Elektronik; Page Part #: MOVPA-0270A; Chip Technology: InGaN; Case/Size Code: 0603; Luminous Intensity: 3000mcd; Peak Wavelength: 520nm; Dominant Wavelength: 525nm; Mount: Surface Mount; Design Item ID: 150060GS84000; Category: Signal LEDs; Component Type: Standard; Emitting Color: Green; Viewing Angle: 40°; Height: 0.95mm; Width: 0.8mm; Length: 1.6mm; JLCPCB Part #: C7429914; Packaging: Tape and Reel; Match Code: WL-SMCW; ComponentLink2Description: Datasheet Link; Forward Voltage: 3.3V; ComponentLink1Description: Website Link; ComponentLink2URL: https://www.we-online.com/redexpert/spec/150060GS84000?ad; Source: WL-SMCW.SchLib; Operating Temperature Max: 85°C; Manufacturer Part Number: 150060GS84000; Pin Count: 2; Operating Temperature Min: -40°C; ComponentLink1URL: https://www.we-online.com/redexpert/article/150060GS84000?ad
D2 = CMP-034-000015-16: WE-TVS TVS Diode - High Speed Series, SOT23-6L, 4+1Channel, 5Vdc; FLIR Part #: YDITA20KV100A; Manufacturer Part Number: SP3051; Manufacturer: Wurth Elektronik; Page Part #: D824015; Reverse Channel Leakage Current: 2uA; Reverse Breakdown Voltage min.: 6.1V; Reverse Peak Pulse Current: 12A; Channel: 4+1; DC Operating Voltage: 5V; Channel Input Capacitance: 2pF; Pin Count: 6; Packaging: Tape and Reel; Source: WE-TVS.SchLib; ComponentLink1Description: Manufacturer; ComponentLink2Description: Datasheet; Mounting Technology: SMT; JLCPCB Part #: C558418; Operating Temperature: -40 to +125degC; Published Date: April 2020; Size: SOT23-6L; ComponentLink2URL: https://www.we-online.com/catalog/datasheet/824015.pdf; Design Item ID: 824015; Component Type: Standard; ComponentLink1URL: http://www.we-online.de
FB1-FB6 = CMP-066-000126-8: as FB12 on sheet DIGLITE; Mount: Surface Mount; Impedance @100MHz: 1000O; JLCPCB Part #: C180490; ComponentLink1URL: https://www.we-online.com/redexpert/article/742792662?ad; ComponentLink2URL: https://www.we-online.com/redexpert/spec/742792662?ad; Length: 1.6mm; ComponentLink1Description: Website Link; Manufacturer Part Number: 742792662; Width: 0.8mm; Match Code: WE-CBF; Component Type: Standard; Design Item ID: 742792662; Pin Count: 2; Operating Temperature Max: 125°C; Packaging: Tape and Reel; ComponentLink2Description: Datasheet Link; Operating Temperature Min: -55°C; Category: Ferrites for PCB Assembly; Height: 0.8mm
FB7 FB8 = CMP-006-00032-6: Ferrite Beads Multi-Layer High Current 110Ohm 25% 100MHz 5.4A 0.015Ohm DCR 1206 T/R; Manufacturer: Wurth Elektronik; Impedance @100MHz: 120O; Case/Size Code: 1206; Impedance Max Test Condition: 500MHz; Match Code: WE-CBF; DC Resistance Max: 0.03O; Impedance Max: 180O; Rated Current: 3A; Mount: Surface Mount; JLCPCB Part #: C85841; ComponentLink1URL: https://www.we-online.com/redexpert/article/742792113?ad; ComponentLink2URL: https://www.we-online.com/redexpert/spec/742792113?ad; Length: 0.126inch; Type: High Current; ComponentLink1Description: Website Link; Width: 1.6mm; Component Type: Standard; Pin Count: 2; Operating Temperature Max: 125°C; Packaging: Tape and Reel; ComponentLink2Description: Datasheet Link; Operating Temperature Min: -55°C; Category: Ferrites for PCB Assembly; Height: 0.051inch; Source: WE-CBF.SchLib
J1 = CMP-088-000027-14: WR-USB 2.0 Type C, Receptacle, Horizontal, SMT; pin to pad: MNT>S1+S2+S3+S4; Manufacturer: Wurth Elektronik; Page Part #: K629722000214; Number of Ports: 1; Working Voltage: 20VAC; Interface Type: Type C; Rated Current: 5A; Category: Input/Output Connectors; ComponentLink1Description: Website Link; Orientation: Horizontal; ComponentLink1URL: https://www.we-online.com/redexpert/article/629722000214?ad; Pin Count: 13; Manufacturer Part Number: 629722000214; ComponentLink2Description: Datasheet Link; Gender: Receptacle; Match Code: WR-USB; Operating Temperature Min: -40°C; Source: WR-USB.SchLib; Number of Pins: 16; Operating Temperature Max: 85°C; Application: USB 2.0; Packaging: Tape and Reel; Mount: Surface Mount; Component Type: Standard; Design Item ID: 629722000214; ComponentLink2URL: https://www.we-online.com/redexpert/spec/629722000214?ad; JLCPCB Part #: C2982555
L1 = CMP-061-000012-8: WE-CNSW SMT Common Mode Line Filter, size 1206, 90Ohm, 0.111uH, 50V; DC Resistance Max: 0.3Ohm; Insulation Test Voltage: 125VAC; Winding Style: bifiliar; Rated Current: 0.37A; Case/Size Code: 1206; Match Code: WE-CNSW; Design Item ID: 744232090; Mount: Surface Mount; Component Type: Standard; Length: 3.2mm; ComponentLink1Description: Manufacturer Link; Packaging: Tape and Reel; ComponentLink2URL: https://www.we-online.com/redexpert/spec/744232090?ad; Operating Temperature Min: -40°C; Operating Temperature Max: 125°C; Width: 1.6mm; ComponentLink2Description: Datasheet; Category: Common Mode Chokes; JLCPCB Part #: C131487; Source: WE-CNSW.SchLib; Impedance @100MHz: 90Ohm; ComponentLink1URL: https://www.we-online.com/redexpert/article/744232090?ad; Height: 1.8mm; Pin Count: 4; Rated Voltage: 50V
L5 = CMP-002-001574-1: Inductor Power Shielded Wirewound 1.5uH 20% 100KHz Powdered Iron 2.2A 99mOhm DCR 1008 T/R; Saturation Current: 3.7A; Core Material: Composite, Ferrite, Metal; DC Resistance (DCR): 82mΩ; Self Resonant Frequency: 60MHz; Height: 1.2mm; Shielding: Shielded; Width: 2mm; Case Code (Imperial): 1008; Max Operating Temperature: 125°C; Test Frequency: 100kHz; Max DC Current: 2.2A; Case/Package: 1008; Inductance Tolerance: 20%; RoHS: Compliant; Height - Seated (Max): 1.1938mm; Pins: 2; Termination: SMD/SMT; Tolerance: 20%; JLCPCB Part #: C161084; Case Code (Metric): 2520; RMS Current (Irms): 2.2A; Current Rating: 2.2A; Ambient Temperature Range High: 85°C; Min Operating Temperature: -40°C; REACH SVHC: Unknown; Weight: 32.006612mg; Ambient Temperature Range Low: -40°C; Mounting Technology: Surface Mount; Length: 2.5mm
R1 = CMP-009-00230-19: Chip Resistor, Thick Film, General Purpose, 0603, 100mW, 50V, 10 Ohm, +/-1%; Page Part #: ROQF1009; Tolerance: 1%; Elements: 1; Temperature Coefficient: 200ppm/°C; Pins: 2; Max Operating Temperature: 155°C; Mounting Technology: SMT; RoHS Compliant: Yes; JLCPCB Part #: C22859; Voltage Rating: 50V; Case/Package: 0603; Resistor Type: Thick Film; Min Operating Temperature: -55°C; Power Rating: 100mW; Usage: General Purpose
R2 R3 = CMP-009-00006-27: as R17 on sheet DIGLITE; Min Operating Temperature: -55°C; RoHS Compliant: True; Usage: Jumper; Mounting Technology: SMT; Max Operating Temperature: 155°C; Case/Package: 0603; JLCPCB Part #: C21189; Current Rating: 1A; Resistor Type: Thick Film; Power Rating: 100mW; Pins: 2; JLCPCB Basic Part: Yes
R4 R24 = CMP-009-00017-29: as R18 on sheet DIGLITE; Pins: 2; Resistor Type: Thick Film; Voltage Rating: 50V; Power Rating: 100mW; Mounting Technology: SMT; Min Operating Temperature: -55°C; Case/Package: 0603; RoHS Compliant: Yes; Usage: General Purpose; JLCPCB Part #: C25804; Max Operating Temperature: 155°C; JLCPCB Basic part: Yes
R5 R6 = CMP-009-00192-22: Chip Resistor, Thick Film, General Purpose, 0603, 100mW, 50V, 5.1 kOhm, +/-1%; Page Part #: ROQF5101; Elements: 1; Tolerance: 1%; Temperature Coefficient: 100ppm/°C; Power Rating: 100mW; Voltage Rating: 50V; Pins: 2; Case/Package: 0603; Usage: General Purpose; Mounting Technology: SMT; JLCPCB Part #: C23186; REACH SVHC: No SVHC; Min Operating Temperature: -55°C; Resistor Type: Thick Film; Max Operating Temperature: 155°C
TP1-TP9 = CMP-027-000000-20: Testpad land; Design Item ID: Testpad; Component Type: Standard; Pin Count: 1
U1 = CMP-015-00044-4: USB Audio Codec improved on CM108AH with crystal-less design; pin to pad: 14>14+36 24>24+33 29>29+34; JLCPCB Part #: C371347

## Sheet AnalogInterface.SchDoc: Radio Interface
size A4; Engineer: CT; SheetNumber: 3; SheetTotal: 3
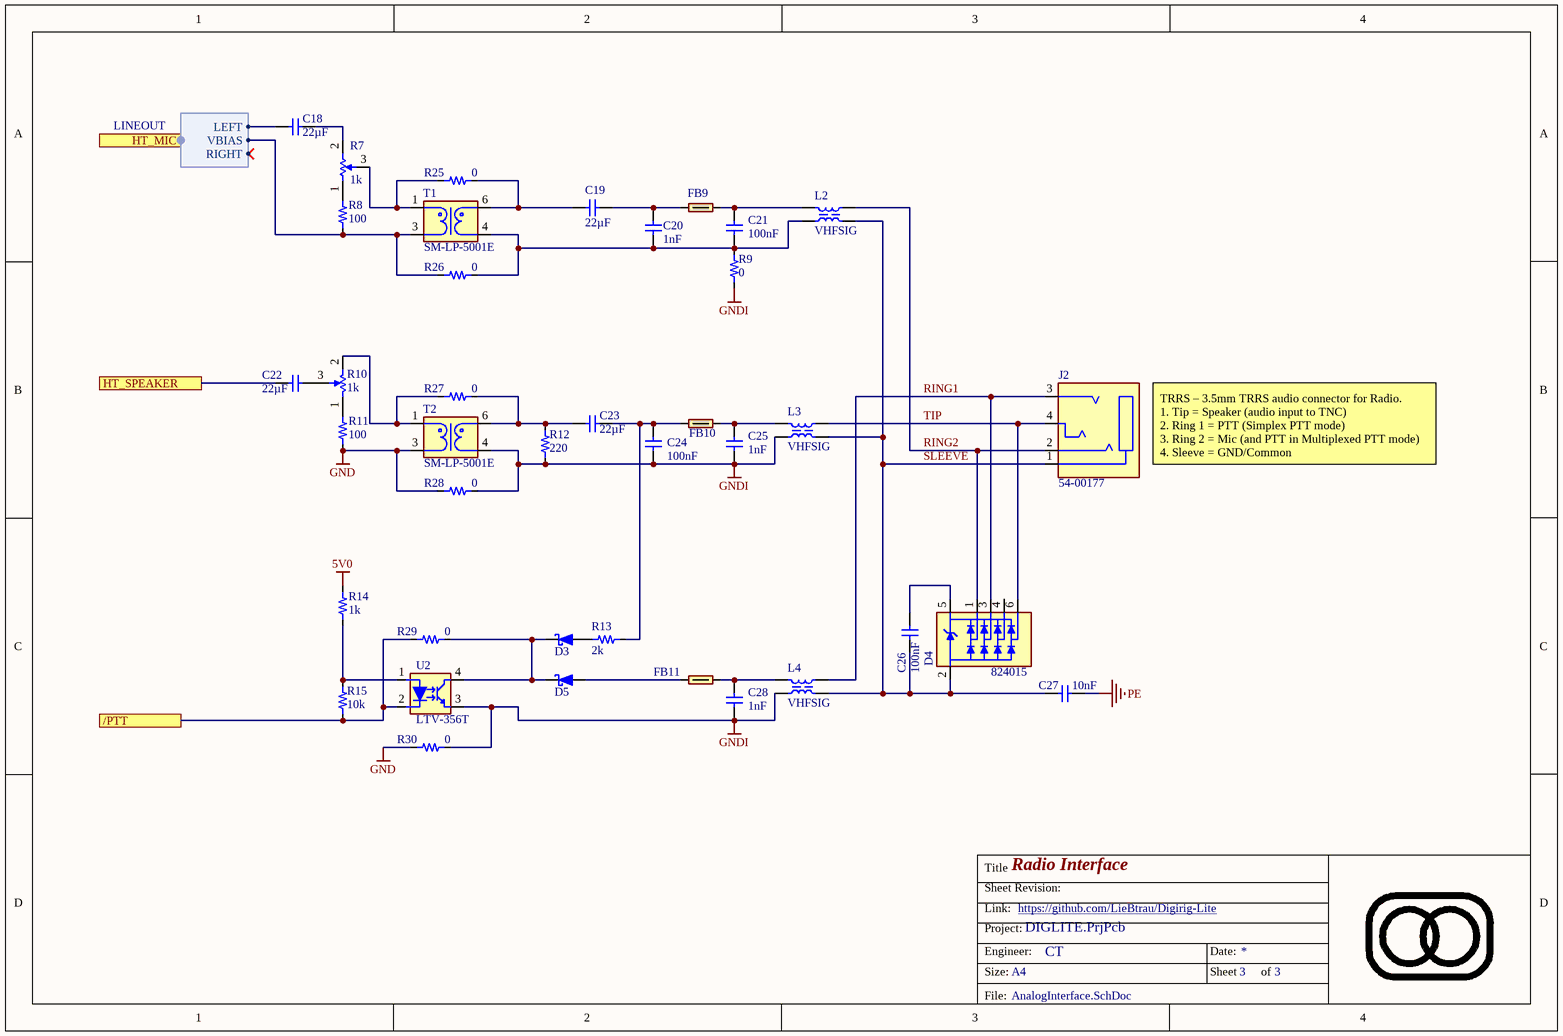
[diagram p2: AnalogInterface.SchDoc]

### Parts
C18  value 22µF  [WCAP-CSGP_1210_L3.2W2.5H2.5]  (hidden comment: Capacitor 22µF +/-10% 10V X7R 1210)
C19  value 22µF  [WCAP-CSGP_1210_L3.2W2.5H2.5]  (hidden comment: Capacitor 22µF +/-10% 10V X7R 1210)
C20  value 1nF  [0603-C-N]  (hidden comment: Capacitor 1 nF +/-5% 50V C0G 0603)
C21  value 100nF  [0603-C-N]  (hidden comment: alternative Capacitor 100nF +/-10% 50V X7R 0603)
C22  value 22µF  [WCAP-CSGP_1210_L3.2W2.5H2.5]  (hidden comment: Capacitor 22µF +/-10% 10V X7R 1210)
C23  value 22µF  [WCAP-CSGP_1210_L3.2W2.5H2.5]  (hidden comment: Capacitor 22µF +/-10% 10V X7R 1210)
C24  value 100nF  [0603-C-N]  (hidden comment: alternative Capacitor 100nF +/-10% 50V X7R 0603)
C25  value 1nF  [0603-C-N]  (hidden comment: Capacitor 1 nF +/-5% 50V C0G 0603)
C26  value 100nF  [0603-C-N]  (hidden comment: alternative Capacitor 100nF +/-10% 50V X7R 0603)
C27  value 10nF  [0603-C-N]  (hidden comment: Capacitor 10nF 50V NP0 0603)
C28  value 1nF  [0603-C-N]  (hidden comment: Capacitor 1 nF +/-5% 50V C0G 0603)
D3  RB521SM-30T2R  [FP-SOD523-MFG]  (value not drawn)
D4  824015  [SOT-23-6]
D5  RB521SM-30T2R  [FP-SOD523-MFG]  (value not drawn)
FB9  742792662  [0603-FB-N]  (value not drawn)
FB10  742792662  [0603-FB-N]  (value not drawn)
FB11  742792662  [0603-FB-N]  (value not drawn)
J2  54-00177  [54-00177-Footprint-1]
L2  value VHFSIG  [WE-CNSW_1206]  (hidden comment: 744232222)
L3  value VHFSIG  [WE-CNSW_1206]  (hidden comment: 744232222)
L4  value VHFSIG  [WE-CNSW_1206]  (hidden comment: 744232222)
R7  value 1k  [3314G-1-102E-Footprint-1]  (hidden comment: 3314G-1-102E)
R8  value 100  [0603-R-N]  (hidden comment: Resistor 100R +/-1% 50V 0603)
R9  value 0  [0603-R-N]  (hidden comment: Jumper 0R <50 mOhm 1A 0603)
R10  value 1k  [3314G-1-102E-Footprint-1]  (hidden comment: 3314G-1-102E)
R11  value 100  [0603-R-N]  (hidden comment: Resistor 100R +/-1% 50V 0603)
R12  value 220  [0603-R-N]  (hidden comment: Resistor 220R +/-1% 0.1W 0603)
R13  value 2k  [0603-R-N]  (hidden comment: Resistor 2k +/-1% 50V 0603)
R14  value 1k  [0603-R-N]  (hidden comment: Resistor 1k +/-1% 50V 0603)
R15  value 10k  [0603-R-N]  (hidden comment: Resistor 10k +/-1% 50V 0603)
R25  value 0  [0603-R-N]  (hidden comment: Jumper 0R <50 mOhm 1A 0603)
R26  value 0  [0603-R-N]  (hidden comment: Jumper 0R <50 mOhm 1A 0603)
R27  value 0  [0603-R-N]  (hidden comment: Jumper 0R <50 mOhm 1A 0603)
R28  value 0  [0603-R-N]  (hidden comment: Jumper 0R <50 mOhm 1A 0603)
R29  value 0  [0603-R-N]  (hidden comment: Jumper 0R <50 mOhm 1A 0603)
R30  value 0  [0603-R-N]  (hidden comment: Jumper 0R <50 mOhm 1A 0603)
T1  SM-LP-5001E  [FP-SM-LP-5001E-MFG]
T2  SM-LP-5001E  [FP-SM-LP-5001E-MFG]
U2  LTV-356T  [LTST-LTV-356T-4_V]

### Ports
/PTT, HT_MIC (harness LINEOUT), HT_SPEAKER

### Harnesses
LINEOUT: LEFT, VBIAS, RIGHT

### Nets
5V0: R14.1
GND: R11.2 R28.1 R30.1 T2.3
GNDI: C24.2 C25.2 C28.2 L3.2 L4.2 R9.1 R12.1 R28.2 R30.2 T2.4 U2.3(EMITTER)
PE: C27.1
HT_MIC: C18.1 ; port HT_MIC.LEFT
HT_SPEAKER: C22.1 ; port HT_SPEAKER
RING1: D4.3 J2.3 L4.4
RING2: D4.1 J2.2 L2.4
SLEEVE: C26.1 C27.2 D4.2 J2.1 L2.1 L3.1 L4.1
TIP: D4.6 J2.4 L3.4
NetC15_1: R8.2 R26.1 T1.3 ; port HT_MIC.VBIAS
NetC18_2: C18.2 R7.2(B)
NetC19_1: C19.1 C20.1 FB9.1
NetC19_2: C19.2 R25.2 T1.6
NetC20_2: C20.2 C21.2 L2.2 R9.2 R26.2 T1.4
NetC21_1: C21.1 FB9.2 L2.3
NetC22_2: C22.2 R10.3(TAP)
NetC23_1: C23.1 R12.2 R27.2 T2.6
NetC23_2: C23.2 C24.1 FB10.2 R13.2
NetC25_1: C25.1 FB10.1 L3.3
NetC26_2: C26.2 D4.5
NetC28_1: C28.1 FB11.2 L4.3
NetD3_1: D3.1(K) D5.1(K) R29.2 U2.4(COLLECTOR)
NetD3_2: D3.2(A) R13.1
NetD5_2: D5.2(A) FB11.1
NetQ1_6: R15.1 R29.1 U2.2(CATHODE) ; port /PTT
NetR7_1: R7.1(A) R8.1
NetR7_3: R7.3(TAP) R25.1 T1.1
NetR10_1: R10.1(A) R11.1
NetR10_2: R10.2(B) R27.1 T2.1
NetR14_2: R14.2 R15.2 U2.1(ANODE)

Not connected (* = marked no-connect by the designer): D4 4

### Notes on the sheet
- TRRS – 3.5mm TRRS audio connector for Radio.
  1. Tip = Speaker (audio input to TNC)
  2. Ring 1 = PTT (Simplex PTT mode)
  3. Ring 2 = Mic (and PTT in Multiplexed PTT mode)
  4. Sleeve = GND/Common
- Title
- Sheet Revision:
- Link:
- Size:
- Project:
- Engineer:
- A4
- Date:
- Sheet
- of
- File:

### Library data of the parts
C18 C19 C22 C23 = CMP-072-000876-16: WCAP-CSGP Multilayer Ceramic Chip Capacitor, General Purpose, size 1210, X7R, 22µF, 10VDC; Page Part #: CCVK226A; Tolerance: 10%; Technical Reference: X7R1210226K010DFCT10000; Insulation Resistance: 0.02GO; Capacitor Type: MLCC; Dissipation Factor: 5%; ComponentLink2URL: https://www.we-online.com/redexpert/spec/885012209006?ad; ComponentLink1URL: https://www.we-online.com/redexpert/article/885012209006?ad; Source: WCAP-CSGP.SchLib; Case/Package: 1210; Packaging: Tape and Reel; ComponentLink1Description: Website Link; Pins: 2; Width: 2.5mm; Voltage Rating: 10V; ComponentLink2Description: Datasheet Link; Match Code: WCAP-CSGP; Max Operating Temperature: 125°C; Usage: General Purpose; JLCPCB Part #: C515687; Height: 2.5mm; Dielectric: X7R; Length: 3.2mm; Min Operating Temperature: -55°C; Design Item ID: 885012209006; Mounting Technology: SMT
C20 C25 C28 = CMP-001-00112-14: as C29 on sheet DIGLITE; Case/Package: 0603; Width: 0.8mm; Min Operating Temperature: -55°C; Mounting Technology: SMT; Dielectric: C0G; Packaging: Cut Tape; Max Operating Temperature: 125°C; Voltage Rating: 50V; Height: 0.8mm; Length: 1.6mm; JLCPCB Part #: C340644; REACH SVHC: Unknown; Capacitor Type: MLCC; Usage: General Purpose; Pins: 2
C21 = CMP-072-000619-17: WCAP-CSGP Multilayer Ceramic Chip Capacitor, General Purpose, size 0603, X7R, 100nF, 50VDC; Tolerance: 10%; Capacitor Type: MLCC; Dissipation Factor: 3%; Insulation Resistance: 5GO; Technical Reference: X7R0603104K050DFCT10000; Case/Package: 0603; Width: 0.8mm; Min Operating Temperature: -55°C; Mounting Technology: SMT; Dielectric: X7R; Packaging: Tape and Reel; Max Operating Temperature: 125°C; Voltage Rating: 50V; Height: 0.8mm; Length: 1.6mm; JLCPCB Part #: C14663; Usage: General Purpose; Pins: 2; ComponentLink2Description: Datasheet Link; ComponentLink2URL: https://www.we-online.com/redexpert/spec/885012206095?ad; Design Item ID: 885012206095; ComponentLink1URL: https://www.we-online.com/redexpert/article/885012206095?ad; Match Code: WCAP-CSGP; Source: WCAP-CSGP.SchLib; ComponentLink1Description: Website Link
C24 = CMP-072-000619-17: as C13 on sheet USB-interface; Case/Package: 0603; Width: 0.8mm; Min Operating Temperature: -55°C; Mounting Technology: SMT; Dielectric: X7R; Packaging: Tape and Reel; Max Operating Temperature: 125°C; Voltage Rating: 50V; Height: 0.8mm; Length: 1.6mm; JLCPCB Part #: C14663; ComponentLink2Description: Datasheet Link; ComponentLink2URL: https://www.we-online.com/redexpert/spec/885012206095?ad; Design Item ID: 885012206095; Pins: 2; ComponentLink1URL: https://www.we-online.com/redexpert/article/885012206095?ad; Match Code: WCAP-CSGP; Source: WCAP-CSGP.SchLib; Usage: General Purpose; ComponentLink1Description: Website Link
C26 = CMP-072-000619-17: as C1 on sheet USB-interface; ComponentLink2Description: Datasheet Link; Dielectric: X7R; ComponentLink2URL: https://www.we-online.com/redexpert/spec/885012206095?ad; Case/Package: 0603; Voltage Rating: 50V; Height: 0.8mm; JLCPCB Part #: C14663; Design Item ID: 885012206095; Pins: 2; Min Operating Temperature: -55°C; Max Operating Temperature: 125°C; Width: 0.8mm; ComponentLink1URL: https://www.we-online.com/redexpert/article/885012206095?ad; Match Code: WCAP-CSGP; Packaging: Tape and Reel; Source: WCAP-CSGP.SchLib; Usage: General Purpose; Length: 1.6mm; ComponentLink1Description: Website Link; Mounting Technology: SMT
C27 = CMP-001-00137-7: as C30 on sheet DIGLITE; Reach SVHC Compliant: No; Case/Package: 0603; Thickness: 0.035inch; Width: 0.8mm; Case Code (Metric): 1608; Termination: SMD/SMT; Min Operating Temperature: -55°C; Voltage Rating (DC): 50V; Mounting Technology: Surface Mount; Package Quantity: 4000; Depth: 0.8mm; Dielectric: C0G; Packaging: Cut Tape; Voltage: 50V; Max Operating Temperature: 125°C; RoHS Compliant: Yes; Material: Ceramic; Lead Pitch: 0.5mm; Case Code (Imperial): 0603; Tolerance: 5%; Voltage Rating: 50V; Lead Free: Lead Free; Height: 0.8mm; Length: 1.6mm; JLCPCB Part #: C85973; Series: GRM
D3 D5 = CMP-004-00062-1: as D6 on sheet DIGLITE; JLCPCB Part #: C727120; Case/Package: SOD-523-2; Packaging: Tape & Reel; Radiation Hardening: No; Max Reverse Voltage (DC): 30V; Width: 800µm; Number of Terminals: 2; Min Operating Temperature: -40°C; Average Rectified Current: 200mA; REACH SVHC: Yes; Max Operating Temperature: 150°C; RoHS: Compliant; Pins: 2; Length: 1.2mm; Peak Non-Repetitive Surge Current: 1A; Lead Free: Lead Free; Reverse Standoff Voltage: 30V; Mounting Technology: Surface Mount; Max Output current: 200mA; Height: 600µm; Lifecycle Status: Production; Weight: 992.233309µg
D4 = CMP-034-000015-16: as D2 on sheet USB-interface; Pin Count: 6; Packaging: Tape and Reel; Source: WE-TVS.SchLib; ComponentLink1Description: Manufacturer; ComponentLink2Description: Datasheet; Mounting Technology: SMT; JLCPCB Part #: C558418; Operating Temperature: -40 to +125degC; Published Date: April 2020; Size: SOT23-6L; ComponentLink2URL: https://www.we-online.com/catalog/datasheet/824015.pdf; Design Item ID: 824015; Component Type: Standard; ComponentLink1URL: http://www.we-online.de
FB9-FB11 = CMP-066-000126-8: as FB12 on sheet DIGLITE; Mount: Surface Mount; Impedance @100MHz: 1000O; JLCPCB Part #: C180490; ComponentLink1URL: https://www.we-online.com/redexpert/article/742792662?ad; ComponentLink2URL: https://www.we-online.com/redexpert/spec/742792662?ad; Length: 1.6mm; ComponentLink1Description: Website Link; Manufacturer Part Number: 742792662; Width: 0.8mm; Match Code: WE-CBF; Component Type: Standard; Design Item ID: 742792662; Pin Count: 2; Operating Temperature Max: 125°C; Packaging: Tape and Reel; ComponentLink2Description: Datasheet Link; Operating Temperature Min: -55°C; Category: Ferrites for PCB Assembly; Height: 0.8mm
J2 = CMP-002-00136-2: as J3 on sheet DIGLITE; Min Operating Temperature: -40°C; Termination: Solder; Mounting Technology: Surface Mount; JLCPCB Part #: C7507452; Max Operating Temperature: 105°C; Contact Plating: Gold; Contact Material: Bronze; Series: -
L2-L4 = CMP-061-000016-12: WE-CNSW SMT Common Mode Line Filter, size 1206, 2200Ohm@100MHz, 1-300MHz, 200mA, 1.2ohm; Page Part #: L744232222; FLIR Part #: YFIL34; Rated Voltage: 50V; Inductance: 2.578uH; Rated Current: 0.2A; Winding Style: bifiliar; Insulation Test Voltage: 125VAC; Case/Size Code: 1206; Category: Common Mode Chokes; DC Resistance Max: 1.2Ohm; Design Item ID: 744232222; Packaging: Tape and Reel; Match Code: WE-CNSW; Length: 3.2mm; ComponentLink1URL: https://www.we-online.com/redexpert/article/744232222?ad; JLCPCB Part #: C3211563; Component Type: Standard; Operating Temperature Max: 125°C; Height: 1.8mm; Source: WE-CNSW.SchLib; ComponentLink1Description: Manufacturer Link; Mount: Surface Mount; Operating Temperature Min: -40°C; Pin Count: 4; Impedance @100MHz: 2200Ohm; Width: 1.6mm; ComponentLink2URL: https://www.we-online.com/redexpert/spec/744232222?ad; ComponentLink2Description: Datasheet
R7 R10 = CMP-009-00389-2: Cermet trimmer potentiometer, 1 kΩ, 0.25 W, SMD, on top, 3314G-1-102E; Tolerance: 20%; Insulation Resistance: 100MR; Number of Turns: 1; Temperature Coefficient: 100ppm/°C; Max Power Dissipation: 250mW; Resistor Type: Cermet; Military Standard: Not; Min Operating Temperature: -55°C; Weight: 0.283g; Resistance Tolerance: 20%; RoHS Compliant: Yes; Reach SVHC Compliant: No; Length: 5mm; Packaging: Tape and Reel; JLCPCB Part #: C780221; Package Quantity: 500; Width: 4.5mm; Height: 2.55mm; Max Operating Temperature: 125°C; Depth: 6.2mm; Radiation Hardening: No; Taper: Linear; Color: Natural; Lead Free: Lead Free; Technology: CERMET; Power Rating: 250mW; Termination: Gull Wing; Mounting Technology: Surface Mount; Series: Trimpot® 3314 - Sealed
R8 R11 = CMP-009-00232-18: as R20 on sheet DIGLITE; Resistor Type: Thick Film; Usage: General Purpose; Voltage Rating: 50V; RoHS Compliant: Yes; JLCPCB Part #: C22775; Mounting Technology: SMT; Case/Package: 0603; Max Operating Temperature: 155°C; Pins: 2; Min Operating Temperature: -55°C
R9 R25-R30 = CMP-009-00006-27: as R17 on sheet DIGLITE; Min Operating Temperature: -55°C; RoHS Compliant: True; Usage: Jumper; Mounting Technology: SMT; Max Operating Temperature: 155°C; Case/Package: 0603; JLCPCB Part #: C21189; Current Rating: 1A; Resistor Type: Thick Film; Power Rating: 100mW; Pins: 2; JLCPCB Basic Part: Yes
R12 = CMP-009-00390-2: Res Thick Film 0603 220 Ohm 1% 0.1W(1/10W) ±100ppm/C Pad SMD T/R Automotive AEC-Q200; Page Part #: ROQF2200; Power Rating: 100mW; Voltage Rating: 75V; Temperature Coefficient: 100ppm/°C; Max Operating Temperature: 155°C; Packaging: Tape and Reel; Length: 0.061inch; Case/Package: 0603; Case Code (Imperial): 0603; Lead Free: Lead Free; Max Power Dissipation: 100mW; Tolerance: 1%; Min Operating Temperature: -55°C; Features: Automotive AEC-Q200; Contact Plating: Tin,Matte; Mounting Technology: Surface Mount; Height: 0.022inch; Radiation Hardening: No; Number of Terminations: 2; Width: 0.031inch; JLCPCB Part #: C22962; Case Code (Metric): 1608; Series: RMCF; RoHS Compliant: Yes
R13 = CMP-009-00298-11: Chip Resistor, Thick Film, General Purpose, 0603, 100mW, 50V, 2 kOhm, +/-1%; Elements: 1; Tolerance: 1%; Resistor Type: Thick Film; Mounting Technology: SMT; Min Operating Temperature: -55°C; Max Operating Temperature: 155°C; Case/Package: 0603; Power Rating: 100mW; JLCPCB Part #: C22975; Voltage Rating: 50V; Pins: 2; Usage: General Purpose
R14 = CMP-009-00014-30: as R21 on sheet DIGLITE; JLCPCB Part #: C21190; Pins: 2; Resistor Type: Thick Film; RoHS Compliant: Yes; Case/Package: 0603; Min Operating Temperature: -55°C; Power Rating: 100mW; Mounting Technology: SMT; Usage: General Purpose; Max Operating Temperature: 155°C; Voltage Rating: 50V; JLCPCB Basic Part: Yes
R15 = CMP-009-00017-29: as R18 on sheet DIGLITE; Pins: 2; Resistor Type: Thick Film; Voltage Rating: 50V; Power Rating: 100mW; Mounting Technology: SMT; Min Operating Temperature: -55°C; Case/Package: 0603; RoHS Compliant: Yes; Usage: General Purpose; JLCPCB Part #: C25804; Max Operating Temperature: 155°C; JLCPCB Basic part: Yes
T1 T2 = CMP-012-00012-1: Audio Transformer 1: 1 2000Vrms 115Ohm Prim. DCR 115Ohm Sec. DCR ±0.25dB 2dB Surface Mount; Return Loss: 24dB; Lead/Base Style: Gull Wing; Value: 3.8H; Operating Frequency: 0.2 to 4 kHz; Turns Ratio: 1:1; Primary Impedance: 600R; DC Resistance (DCR): 115R; Shielding: Unshielded; Isolation Voltage: 1.5kV; Height: 7.36mm; RoHS Compliant: Yes; JLCPCB Part #: C840532; Mounting Technology: Surface Mount; Termination: SMD/SMT; Depth: 14mm; Length: 12.5mm; Pins: 6; Series: SM-LP-5001; Max Operating Temperature: 85°C; Packaging: Tape and Reel; Insertion Loss: 2dB; Width: 9.6mm; Reach SVHC Compliant: No; Secondary Impedance: 600R; Package Quantity: 400; Min Operating Temperature: -20°C
U2 = CMP-00026-00001-8: LTV Series Single Channel 80 V 3750 Vrms Transistor Output Optocoupler SMT DIP-4; Page Part #: ZOCLTV356T; JLCPCB Part #: C125117